# Altium project SpinASM.PrjPCB
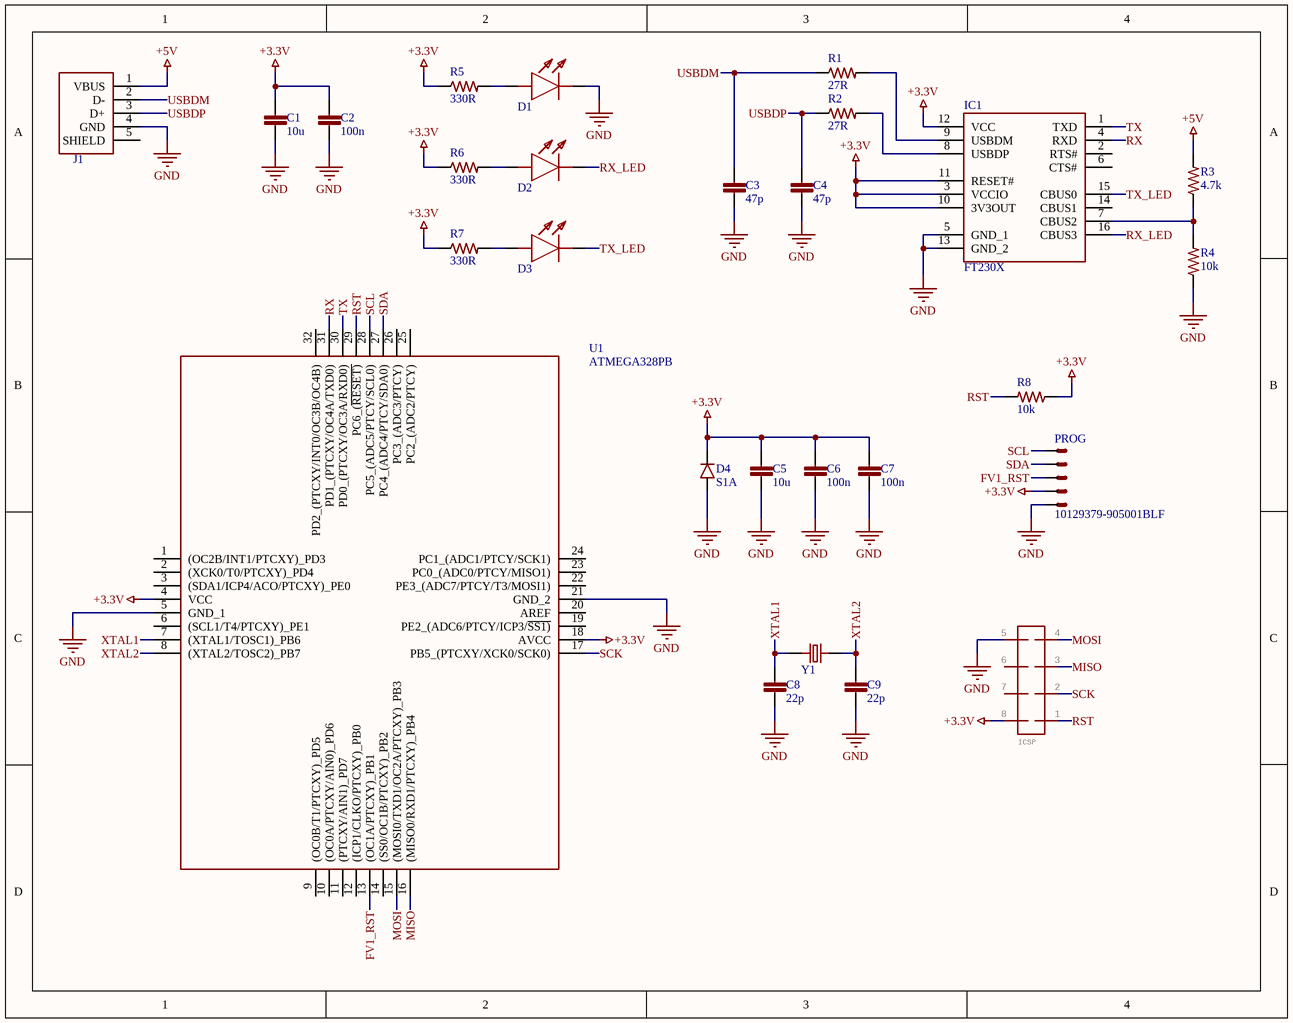
[diagram p0: SpinASM.SchDoc]
1 sheet, 27 parts. Net scope: global (net labels, ports and power ports of the same name join across sheets).
Board files: Panel.PcbDoc, SpinASM.PcbDoc

## Sheet SpinASM.SchDoc
size A

### Parts
C1  10u  [CHIP_1206]
C2  100n  [CHIP_0603]
C3  47p  [CHIP_0603]
C4  47p  [CHIP_0603]
C5  10u  [CHIP_1206]
C6  100n  [CHIP_0603]
C7  100n  [CHIP_0603]
C8  22p  [CHIP_0603]
C9  22p  [CHIP_0603]
D1  GREEN  [LED_0603]  (value not drawn)
D2  RED  [LED_0603]  (value not drawn)
D3  RED  [LED_0603]  (value not drawn)
D4  S1A  [DO214]
IC1  FT230X  [TSSOP-16]
ICSP  J_SOICBITE  [SOICBITE]  (value not drawn)
J1  USB_MALE  [USB_MALE]  (value not drawn)
PROG  10129379-905001BLF  [HEADER_5PINS_MALE_90]
R1  27R  [CHIP_R_0603]
R2  27R  [CHIP_R_0603]
R3  4.7k  [CHIP_R_0603]
R4  10k  [CHIP_R_0603]
R5  330R  [CHIP_R_0603]
R6  330R  [CHIP_R_0603]
R7  330R  [CHIP_R_0603]
R8  10k  [CHIP_R_0603]
U1  ATMEGA328PB  [TQFP32]
Y1  ABM10  [ABM10-167]  (value not drawn)

### Nets
+3.3V: C1.2 C2.1 C5.2 C6.1 C7.1 D4.1 IC1.3(VCCIO) IC1.10(3V3OUT) IC1.11(RESET#) IC1.12(VCC) ICSP.8(P$8) PROG.2(S) R5.1 R6.1 R7.1 R8.1 U1.4(VCC) U1.18(AVCC)
+5V: J1.1(VBUS) R3.2
GND: C1.1 C2.2 C3.2 C4.2 C5.1 C6.2 C7.2 C8.2 C9.2 D1.1(K) D4.2 IC1.5(GND_1) IC1.13(GND_2) ICSP.5(P$5) J1.4(GND) PROG.1(S) R4.1 U1.5(GND_1) U1.21(GND_2)
FV1_RST: PROG.3(S) U1.13((OC1A/PTCXY)_PB1)
MISO: ICSP.3(P$3) U1.16((MISO0/RXD1/PTCXY)_PB4)
MOSI: ICSP.4(P$4) U1.15((MOSI0/TXD1/OC2A/PTCXY)_PB3)
RST: ICSP.1(P$1) R8.2 U1.29(PC6_(~{RESET)})
RX: IC1.4(RXD) U1.31(PD1_(PTCXY/OC4A/TXD0))
RX_LED: D2.1(K) IC1.16(CBUS3)
SCK: ICSP.2(P$2) U1.17(PB5_(PTCXY/XCK0/SCK0))
SCL: PROG.5(S) U1.28(PC5_(ADC5/PTCY/SCL0))
SDA: PROG.4(S) U1.27(PC4_(ADC4/PTCY/SDA0))
TX: IC1.1(TXD) U1.30(PD0_(PTCXY/OC3A/RXD0))
TX_LED: D3.1(K) IC1.15(CBUS0)
USBDM: C3.1 J1.2(D-) R1.1
USBDP: C4.1 J1.3(D+) R2.1
XTAL1: C8.1 U1.7((XTAL1/TOSC1)_PB6) Y1.1
XTAL2: C9.1 U1.8((XTAL2/TOSC2)_PB7) Y1.2
NetD1_2: D1.2(A) R5.2
NetD2_2: D2.2(A) R6.2
NetD3_2: D3.2(A) R7.2
NetIC1_7: IC1.7(CBUS2) R3.1 R4.2
NetIC1_8: IC1.8(USBDP) R2.2
NetIC1_9: IC1.9(USBDM) R1.2

Not connected (* = marked no-connect by the designer): IC1 2(RTS#) 6(CTS#) 14(CBUS1); ICSP 6(P$6) 7(P$7); J1 5(SHIELD); U1 1((OC2B/INT1/PTCXY)_PD3) 2((XCK0/T0/PTCXY)_PD4) 3((SDA1/ICP4/ACO/PTCXY)_PE0) 6((SCL1/T4/PTCXY)_PE1) 9((OC0B/T1/PTCXY)_PD5) 10((OC0A/PTCXY/AIN0)_PD6) 11((PTCXY/AIN1)_PD7) 12((ICP1/CLKO/PTCXY)_PB0) 14((SS0/OC1B/PTCXY)_PB2) 19(PE2_(ADC6/PTCY/ICP3/~{SS1)}) 20(AREF) 22(PE3_(ADC7/PTCY/T3/MOSI1)) 23(PC0_(ADC0/PTCY/MISO1)) 24(PC1_(ADC1/PTCY/SCK1)) 25(PC2_(ADC2/PTCY)) 26(PC3_(ADC3/PTCY)) 32(PD2_(PTCXY/INT0/OC3B/OC4B))

### Library data of the parts
C1 C5 = TMK316B7106KL-TD: CAP CER 10uF 25V X7R 1206; Manufacturer: Taiyo Yuden; Tolerance: 10%; Supplier 1: Farnell; Supplier Part Number 1: 2113073; Manufacturer Part Number: TMK316B7106KL-TD; RoHS: Yes; Category: Ceramic Capacitors; Stock: 588931; Mount: Surface Mount; Case/Package: 1206; Number of Pins: 2; Case Code (Imperial): 1206; Case Code (Metric): 3216; Weight: 0.000571oz; Min Operating Temperature: -55°C; Max Operating Temperature: 125°C; Capacitance: 10uF; Voltage Rating: 25V; Packaging: Tape and Reel; Dielectric: X7R; Voltage Rating (DC): 25V; Package Quantity: 1; Termination: SMD/SMT; Resistor Type: Ceramic; Length: 0.126inch; Width: 1.6mm; Height: 1.6mm; Thickness: 0.071inch; REACH SVHC: Unknown; ComponentLink1URL: https://datasheet.ciiva.com/15922/582tmk316ab7106kl-t-15922403.pdf?src-supplier=Onlinecomponents.com; ComponentLink1Description: https://datasheet.ciiva.com/15922/582tmk316ab7106kl-t-15922403.pdf?src-supplier=Onlinecomponents.com; ComponentLink2URL: https://datasheet.ciiva.com/7975/1784422-7975593.pdf?src-supplier=Element14; ComponentLink2Description: https://datasheet.ciiva.com/7975/1784422-7975593.pdf?src-supplier=Element14; ComponentLink3URL: https://datasheet.ciiva.com/30123/25tmk316ab7106kl-t-30123726.pdf?src-supplier=Onlinecomponents.com; ComponentLink3Description: https://datasheet.ciiva.com/30123/25tmk316ab7106kl-t-30123726.pdf?src-supplier=Onlinecomponents.com; ComponentLink4URL: https://datasheet.ciiva.com/7975/mlcc-all-e-7975834.pdf?src-supplier=Element14; ComponentLink4Description: https://datasheet.ciiva.com/7975/mlcc-all-e-7975834.pdf?src-supplier=Element14; ComponentLink5URL: https://datasheet.ciiva.com/139/mlcc-all-e-139531.pdf?src-supplier=Digi-Key; ComponentLink5Description: https://datasheet.ciiva.com/139/mlcc-all-e-139531.pdf?src-supplier=Digi-Key; ComponentLink6URL: https://datasheet.ciiva.com/22748/1481447-22748971.pdf?src-supplier=Element14; ComponentLink6Description: https://datasheet.ciiva.com/22748/1481447-22748971.pdf?src-supplier=Element14; ComponentLink7URL: https://datasheet.ciiva.com/139/mlcc-all-e-139532.pdf?src-supplier=Digi-Key; ComponentLink7Description: https://datasheet.ciiva.com/139/mlcc-all-e-139532.pdf?src-supplier=Digi-Key; ComponentLink8URL: https://datasheet.ciiva.com/139/mlcc-all-e-139533.pdf?src-supplier=Digi-Key; ComponentLink8Description: https://datasheet.ciiva.com/139/mlcc-all-e-139533.pdf?src-supplier=Digi-Key; Price: 0.149
C2 C6 C7 = MC0603B104K500CT: CAP CER 100NF 50V X7R 0603; Manufacturer: Multicomp; Tolerance: 10%; Supplier 1: Farnell; Supplier Part Number 1: 1759122; Manufacturer Part Number: MC0603B104K500CT; Stock 1: 1057763; RoHS: Yes; Case/Package: 0603; Number of Pins: 2; Case Code (Metric): 1608; Case Code (Imperial): 0603; Min Operating Temperature: -55°C; Max Operating Temperature: 125°C; Packaging: Cut Tape; Voltage Rating: 50V; Capacitance: 100nF; Dielectric: X7R; Voltage Rating (DC): 50V; REACH SVHC: Unknown; ComponentLink1URL: https://datasheet.ciiva.com/22686/1901289-22686278.pdf?src-supplier=Element14; ComponentLink1Description: https://datasheet.ciiva.com/22686/1901289-22686278.pdf?src-supplier=Element14; ComponentLink2URL: https://datasheet.ciiva.com/22686/1901289-22686279.pdf?src-supplier=Element14; ComponentLink2Description: https://datasheet.ciiva.com/22686/1901289-22686279.pdf?src-supplier=Element14; ComponentLink3URL: https://datasheet.ciiva.com/22648/1901289-22648411.pdf?src-supplier=Element14; ComponentLink3Description: https://datasheet.ciiva.com/22648/1901289-22648411.pdf?src-supplier=Element14; Price: 0.0458
C3 C4 = MC0603N470J500CT: CAP CER 47PF 50V C0G/NP0 0603; Manufacturer: Multicomp; Tolerance: 5%; Dielectric: C0G; Temperature Coefficient: 30ppm/°C; Supplier 1: Farnell; Supplier Part Number 1: 1759062; Manufacturer Part Number: MC0603N470J500CT; Stock: 148629; Pricing: 10=0.0246, 100=0.0199, 500=0.0123, 1000=0.0097, 2000=0.0089 (EUR); RoHS: Yes; Case/Package: 0603; Number of Pins: 2; Case Code (Metric): 1608; Case Code (Imperial): 0603; Min Operating Temperature: -55°C; Max Operating Temperature: 125°C; Packaging: Tape and Reel; Voltage Rating: 50V; Capacitance: 47pF; Voltage Rating (DC): 50V; Width: 0.8mm; REACH SVHC: Unknown; ComponentLink1URL: https://datasheet.ciiva.com/22648/1901289-22648503.pdf?src-supplier=Element14; ComponentLink1Description: https://datasheet.ciiva.com/22648/1901289-22648503.pdf?src-supplier=Element14; ComponentLink2URL: https://datasheet.ciiva.com/22682/1901289-22682812.pdf?src-supplier=Element14; ComponentLink2Description: https://datasheet.ciiva.com/22682/1901289-22682812.pdf?src-supplier=Element14; ComponentLink3URL: https://datasheet.ciiva.com/22682/1901289-22682813.pdf?src-supplier=Element14; ComponentLink3Description: https://datasheet.ciiva.com/22682/1901289-22682813.pdf?src-supplier=Element14; Price: 0.02
C8 C9 = MC0603N220J500CT: CAP CER 22PF 50V C0G/NP0 0603; Manufacturer: Multicomp; Temperature Coefficient: 30ppm/°C; Dielectric: C0G; Tolerance: 5%; Supplier 1: Farnell; Supplier Part Number 1: 1759057; Manufacturer Part Number: MC0603N220J500CT; RoHS: Yes; Category: Ceramic Capacitors; Stock: 53792; Case/Package: 0603; Number of Pins: 2; Case Code (Imperial): 0603; Case Code (Metric): 1608; Min Operating Temperature: -55°C; Max Operating Temperature: 125°C; Voltage Rating (DC): 50V; Capacitance: 22pF; Voltage Rating: 50V; Packaging: Cut Tape; Width: 0.8mm; REACH SVHC: Unknown; ComponentLink1URL: https://datasheet.ciiva.com/22648/1901289-22648486.pdf?src-supplier=Element14; ComponentLink1Description: https://datasheet.ciiva.com/22648/1901289-22648486.pdf?src-supplier=Element14; Price: 0.024
D1 = APT1608SGC: LED GREEN CLEAR CHIP SMD; Manufacturer: Kingbright; Forward Voltage: 2.2V; Viewing Angle: 120°; Forward Current: 20mA; Luminous Intensity: 15mcd; Lens Style: Clear,Flat; Dominant Wavelength: 568nm; Number of LEDs: 1; Supplier 1: Mouser; Supplier Part Number 1: 604-APT1608SGC; Manufacturer Part Number: APT1608SGC; RoHS: Yes; Category: LEDs; Stock: 233491; Pricing: 1=0.17000, 10=0.10700, 100=0.05600, 1000=0.05100, 2000=0.04400, 10000=0.03700 (USD); Mount: Surface Mount; Case/Package: 0603; Number of Pins: 2; Color: Green; Case Code (Metric): 1608; Case Code (Imperial): 0603; Lens Color: Clear; Min Operating Temperature: -40°C; Max Operating Temperature: 85°C; Package Quantity: 2000; Illumination Color: Green; Packaging: Tape and Reel; Test Current: 20mA; Wavelength: 568nm; Length: 1.6mm; Height: 0.75mm; Width: 0.8mm; Lead Free: Lead Free; ComponentLink1URL: https://datasheet.ciiva.com/2113/apt1608sgc-2113808.pdf?src-supplier=Digi-Key; ComponentLink1Description: https://datasheet.ciiva.com/2113/apt1608sgc-2113808.pdf?src-supplier=Digi-Key; ComponentLink2URL: https://datasheet.ciiva.com/12400/apt1608sgc-32861-12400932.pdf?src-supplier=Mouser; ComponentLink2Description: https://datasheet.ciiva.com/12400/apt1608sgc-32861-12400932.pdf?src-supplier=Mouser; ComponentLink3URL: https://datasheet.ciiva.com/14603/70062839-14603927.pdf?src-supplier=Allied+Electronics; ComponentLink3Description: https://datasheet.ciiva.com/14603/70062839-14603927.pdf?src-supplier=Allied+Electronics; Price: 0.047
D2 D3 = APT1608EC: LED RED CLEAR CHIP SMD; Manufacturer: Kingbright; Forward Current: 20mA; Forward Voltage: 2V; Luminous Intensity: 12mcd; Viewing Angle: 120°; Lens Style: Clear,Flat; Dominant Wavelength: 625nm; Number of LEDs: 1; Supplier 1: Mouser; Supplier Part Number 1: 604-APT1608EC; Manufacturer Part Number: APT1608EC; RoHS: Yes; Category: LEDs; Stock: 24294; Pricing: 1=0.16000, 10=0.11500, 100=0.06200, 1000=0.04300, 2000=0.03600, 10000=0.03600 (USD); Mount: Surface Mount; Case/Package: 0603; Number of Pins: 2; Color: Red; Case Code (Metric): 1608; Case Code (Imperial): 0603; Lens Color: Clear; Min Operating Temperature: -40°C; Max Operating Temperature: 85°C; Illumination Color: Red; Packaging: Tape and Reel; Package Quantity: 2000; Test Current: 20mA; Wavelength: 625nm; Length: 1.6mm; Height: 0.75mm; Width: 0.8mm; Lead Free: Lead Free; ComponentLink1URL: https://datasheet.ciiva.com/2113/apt1608ec-2113818.pdf?src-supplier=Digi-Key; ComponentLink1Description: https://datasheet.ciiva.com/2113/apt1608ec-2113818.pdf?src-supplier=Digi-Key; ComponentLink2URL: https://datasheet.ciiva.com/12400/apt1608ec-34957-12400703.pdf?src-supplier=Mouser; ComponentLink2Description: https://datasheet.ciiva.com/12400/apt1608ec-34957-12400703.pdf?src-supplier=Mouser; ComponentLink3URL: https://datasheet.ciiva.com/2113/apt1608ec-2113819.pdf?src-supplier=Digi-Key; ComponentLink3Description: https://datasheet.ciiva.com/2113/apt1608ec-2113819.pdf?src-supplier=Digi-Key; ComponentLink4URL: https://datasheet.ciiva.com/2113/apt1608ec-2113820.pdf?src-supplier=Digi-Key; ComponentLink4Description: https://datasheet.ciiva.com/2113/apt1608ec-2113820.pdf?src-supplier=Digi-Key; ComponentLink5URL: https://datasheet.ciiva.com/14604/70062836-14604396.pdf?src-supplier=Allied+Electronics; ComponentLink5Description: https://datasheet.ciiva.com/14604/70062836-14604396.pdf?src-supplier=Allied+Electronics; ComponentLink6URL: https://datasheet.ciiva.com/16412/apt1608ec-16412172.pdf?src-supplier=Future+Electronics; ComponentLink6Description: https://datasheet.ciiva.com/16412/apt1608ec-16412172.pdf?src-supplier=Future+Electronics; Price: 0.053
D4 = S1A: DIODE GEN PURP 50V 1A SMA; Manufacturer: ON Semiconductor / Fairchild; Peak Reverse Current: 1uA; Max Surge Current: 40A; Forward Voltage: 1.1V; Peak Non-Repetitive Surge Current: 30A; Element Configuration: Single; Capacitance: 12pF; Recovery Time: 1800ns; Reverse Recovery Time: 1.8us; Polarity: Standard; Power Dissipation: 1.4W; Supplier 1: Farnell; Supplier Part Number 1: 9843868; Manufacturer Part Number: S1A; Stock: 34555; Pricing: 5=0.184, 25=0.179, 100=0.0727, 250=0.0669, 500=0.0667, 1000=0.0364, 5000=0.0293 (EUR); RoHS: Yes; Mount: Surface Mount; Case/Package: SMA; Number of Pins: 2; Weight: 0.106g; Contact Plating: Tin; Min Operating Temperature: -55°C; Max Operating Temperature: 150°C; Packaging: Tape and Reel; Package Quantity: 1; Voltage Rating (DC): 50V; Current Rating: 1A; Output Current: 1A; Forward Current: 1A; Max Repetitive Reverse Voltage (Vrrm): 50V; Average Rectified Current: 1A; Max Forward Surge Current (Ifsm): 30A; Max Reverse Voltage (DC): 50V; Reverse Voltage: 50V; Width: 5.28mm; Radiation Hardening: No; REACH SVHC: No SVHC; Lead Free: Lead Free; ComponentLink1URL: https://datasheet.ciiva.com/910/s1a-910480.pdf?src-supplier=Avnet; ComponentLink1Description: https://datasheet.ciiva.com/910/s1a-910480.pdf?src-supplier=Avnet; ComponentLink2URL: https://datasheet.ciiva.com/23683/1730038-23683616.pdf?src-supplier=Newark; ComponentLink2Description: https://datasheet.ciiva.com/23683/1730038-23683616.pdf?src-supplier=Newark; ComponentLink3URL: https://datasheet.ciiva.com/4452/s1a-191336-4452662.pdf?src-supplier=Mouser; ComponentLink3Description: https://datasheet.ciiva.com/4452/s1a-191336-4452662.pdf?src-supplier=Mouser; ComponentLink4URL: https://datasheet.ciiva.com/25624/0900766b80f9b629-25624903.pdf?src-supplier=RSComponents; ComponentLink4Description: https://datasheet.ciiva.com/25624/0900766b80f9b629-25624903.pdf?src-supplier=RSComponents; ComponentLink5URL: https://datasheet.ciiva.com/916/s1a-916898.pdf?src-supplier=Digi-Key; ComponentLink5Description: https://datasheet.ciiva.com/916/s1a-916898.pdf?src-supplier=Digi-Key; ComponentLink6URL: https://datasheet.ciiva.com/916/s1a-916899.pdf?src-supplier=Digi-Key; ComponentLink6Description: https://datasheet.ciiva.com/916/s1a-916899.pdf?src-supplier=Digi-Key; ComponentLink7URL: https://datasheet.ciiva.com/916/s1a-916900.pdf?src-supplier=Digi-Key; ComponentLink7Description: https://datasheet.ciiva.com/916/s1a-916900.pdf?src-supplier=Digi-Key; ComponentLink8URL: https://datasheet.ciiva.com/16800/s1a-16800103.pdf?src-supplier=Future+Electronics; ComponentLink8Description: https://datasheet.ciiva.com/16800/s1a-16800103.pdf?src-supplier=Future+Electronics; ComponentLink9URL: https://datasheet.ciiva.com/28469/1766308-28469031.pdf?src-supplier=Element14; ComponentLink9Description: https://datasheet.ciiva.com/28469/1766308-28469031.pdf?src-supplier=Element14; ComponentLink10URL: https://datasheet.ciiva.com/26231/s1k-26231832.pdf?src-supplier=Avnet+Europe; ComponentLink10Description: https://datasheet.ciiva.com/26231/s1k-26231832.pdf?src-supplier=Avnet+Europe; ComponentLink11URL: https://datasheet.ciiva.com/16474/s1k-16474283.pdf?src-supplier=Avnet+Asia; ComponentLink11Description: https://datasheet.ciiva.com/16474/s1k-16474283.pdf?src-supplier=Avnet+Asia; Price: 0.072
IC1 = FT230XS-R: USB-to-UART 1-CH 512byte FIFO 5V 16-Pin SSOP T/R; Manufacturer: FTDI; Data Rate: 12Mbps; Number of Channels: 1; Max Supply Voltage: 5.5V; Min Supply Voltage: 2.97V; Interface: UART,USB; Operating Supply Current: 8mA; Supplier 1: Farnell; Supplier Part Number 1: 2081321; Manufacturer Part Number: FT230XS-R; RoHS: Yes; Category: Interface ICs; Stock 1: 45264; Mount: Surface Mount; Case/Package: SSOP; Number of Pins: 16; Weight: 0.004586oz; Min Operating Temperature: -40°C; Max Operating Temperature: 85°C; Packaging: Tape and Reel; Package Quantity: 3000; Operating Supply Voltage: 5V; Length: 5mm; Height: 0.059inch; Width: 0.157inch; ComponentLink1URL: https://datasheet.ciiva.com/1787/ds-ft230x-1787315.pdf?src-supplier=Digi-Key; ComponentLink1Description: https://datasheet.ciiva.com/1787/ds-ft230x-1787315.pdf?src-supplier=Digi-Key; ComponentLink2URL: https://datasheet.ciiva.com/4787/ds-ft230x-5395-4787571.pdf?src-supplier=Mouser; ComponentLink2Description: https://datasheet.ciiva.com/4787/ds-ft230x-5395-4787571.pdf?src-supplier=Mouser; ComponentLink3URL: https://datasheet.ciiva.com/30478/0900766b811020cb-30478167.pdf?src-supplier=RSComponents; ComponentLink3Description: https://datasheet.ciiva.com/30478/0900766b811020cb-30478167.pdf?src-supplier=RSComponents; ComponentLink4URL: https://datasheet.ciiva.com/1787/ft-x-series-1787316.pdf?src-supplier=Digi-Key; ComponentLink4Description: https://datasheet.ciiva.com/1787/ft-x-series-1787316.pdf?src-supplier=Digi-Key; ComponentLink5URL: https://datasheet.ciiva.com/1787/ft-x-series-1787317.pdf?src-supplier=Digi-Key; ComponentLink5Description: https://datasheet.ciiva.com/1787/ft-x-series-1787317.pdf?src-supplier=Digi-Key; Price: 1.73
ICSP = J_SOICBITE: GateName_1: G$1; SymbolName_1: SOICBITE; LibraryName: SOICbite_Eagle; DeviceSetName: SOICBITE; Package: SOICBITE
J1 = KUSBX-SMT2AP5S-W: Conn USB Type A PL 4 POS 2mm Solder ST SMD 4 Terminal 1 Port; Manufacturer: Kycon; Number of Ports: 1; Number of Contacts: 4; Connector Type: USB,Plug; Insulation Resistance: 1GR; Gender: Male; Current Rating: 1A; Supplier 1: Mouser; Manufacturer Part Number: KUSBX-SMT2AP5S-W; RoHS: Yes; Category: USB Connectors; Mount: Surface Mount; Housing Material: Thermoplastic; Contact Plating: Gold; Contact Material: Bronze; Color: Black; Termination: SMD/SMT; Orientation: Straight; Packaging: Tray; Pitch: 2mm; Radiation Hardening: No; ComponentLink1URL: https://datasheet.ciiva.com/12494/kusbx-371999-12494840.pdf?src-supplier=Mouser; ComponentLink1Description: https://datasheet.ciiva.com/12494/kusbx-371999-12494840.pdf?src-supplier=Mouser; Price: 0.735; Stock 1: 8377; Package Quantity: 100; Number of Positions: 4; Flammability Rating: UL94 V-0
PROG = 10129379-905001BLF: Conn Unshrouded Header HDR 5 POS 2.54mm Solder RA Thru-Hole Poly Bag; Manufacturer: ICC; Supplier 1: Mouser; Supplier Part Number 1: 649-1012937990501BLF; Manufacturer Part Number: 10129379-905001BLF; Stock: 5866; Pricing: 1=0.26000, 10=0.18200, 100=0.15000, 1000=0.12500, 2500=0.11200, 10000=0.09600, 25000=0.09500, 50000=0.09300, 100000=0.08900 (USD); ComponentLink1URL: http://datasheet.octopart.com/10129379-905001BLF-Amphenol-ICC-datasheet-100454231.pdf?src-supplier=Newark; ComponentLink1Description: http://datasheet.octopart.com/10129379-905001BLF-Amphenol-ICC-datasheet-100454231.pdf?src-supplier=Newark; ComponentLink2URL: http://datasheet.octopart.com/10129379-905001BLF-ICC-datasheet-100454231.pdf?src-supplier=Newark; ComponentLink2Description: http://datasheet.octopart.com/10129379-905001BLF-ICC-datasheet-100454231.pdf?src-supplier=Newark; Price: 0.154
R1 R2 = CRCW060327R0FKEA: RES SMD 27 OHM 1% 1/10W 0603; Manufacturer: Vishay; Power Rating: 100mW; Temperature Coefficient: 100ppm/°C; Voltage Rating: 75V; Supplier 1: Farnell; Supplier Part Number 1: 2141211; Manufacturer Part Number: CRCW060327R0FKEA; RoHS: Yes; Category: Chip SMD Resistors; Stock 1: 1183; Mount: Surface Mount; Case/Package: 0603; Number of Pins: 2; Weight: 7.1E-05oz; Contact Plating: Tin; Case Code (Imperial): 0603; Case Code (Metric): 1608; Min Operating Temperature: -55°C; Max Operating Temperature: 155°C; Resistance: 27R; Tolerance: 1%; Composition: Thick Film; Packaging: Tape and Reel; Termination: SMD/SMT; Package Quantity: 5000; Military Standard: Not; Voltage Rating (DC): 75V; Length: 1.55mm; Height: 0.45mm; Width: 0.85mm; Depth: 0.85mm; Radiation Hardening: No; REACH SVHC: Unknown; Lead Free: Lead Free; ComponentLink1URL: https://datasheet.ciiva.com/11809/0900766b80d98afc-11809194.pdf?src-supplier=RSComponents; ComponentLink1Description: https://datasheet.ciiva.com/11809/0900766b80d98afc-11809194.pdf?src-supplier=RSComponents; ComponentLink2URL: https://datasheet.ciiva.com/5541/dcrcwe3-109170-5541782.pdf?src-supplier=Mouser; ComponentLink2Description: https://datasheet.ciiva.com/5541/dcrcwe3-109170-5541782.pdf?src-supplier=Mouser; ComponentLink3URL: https://datasheet.ciiva.com/7792/125364-7792167.pdf?src-supplier=Element14; ComponentLink3Description: https://datasheet.ciiva.com/7792/125364-7792167.pdf?src-supplier=Element14; ComponentLink4URL: https://datasheet.ciiva.com/22704/1697337-22704440.pdf?src-supplier=Element14; ComponentLink4Description: https://datasheet.ciiva.com/22704/1697337-22704440.pdf?src-supplier=Element14; ComponentLink5URL: https://datasheet.ciiva.com/7672/1697337-7672889.pdf?src-supplier=Element14; ComponentLink5Description: https://datasheet.ciiva.com/7672/1697337-7672889.pdf?src-supplier=Element14; ComponentLink6URL: https://datasheet.ciiva.com/7672/1697337-7672890.pdf?src-supplier=Element14; ComponentLink6Description: https://datasheet.ciiva.com/7672/1697337-7672890.pdf?src-supplier=Element14; ComponentLink7URL: https://datasheet.ciiva.com/16882/dcrcwe3-16882811.pdf?src-supplier=Avnet+Europe; ComponentLink7Description: https://datasheet.ciiva.com/16882/dcrcwe3-16882811.pdf?src-supplier=Avnet+Europe; ComponentLink8URL: https://datasheet.ciiva.com/22870/70201119-22870860.pdf?src-supplier=Allied+Electronics; ComponentLink8Description: https://datasheet.ciiva.com/22870/70201119-22870860.pdf?src-supplier=Allied+Electronics; ComponentLink9URL: https://datasheet.ciiva.com/16498/dcrcwe3-16498302.pdf?src-supplier=Future+Electronics; ComponentLink9Description: https://datasheet.ciiva.com/16498/dcrcwe3-16498302.pdf?src-supplier=Future+Electronics; ComponentLink10URL: https://datasheet.ciiva.com/16780/70201119-16780479.pdf?src-supplier=Allied+Electronics; ComponentLink10Description: https://datasheet.ciiva.com/16780/70201119-16780479.pdf?src-supplier=Allied+Electronics; Price: 0.0165
R3 = CRCW06034K70FKEA: RES SMD 4.7K OHM 1% 1/10W 0603; Manufacturer: Vishay; Resistance: 4.7kR; Temperature Coefficient: 100ppm/°C; Power Rating: 100mW; Voltage Rating: 75V; Supplier 1: Farnell; Supplier Part Number 1: 1469807; Manufacturer Part Number: CRCW06034K70FKEA; Stock: 238464; Pricing: 10=0.0169, 100=0.013, 500=0.0113, 1000=0.0074 (EUR); RoHS: Yes; Mount: Surface Mount; Case/Package: 0603; Weight: 7.1E-05oz; Contact Plating: Tin; Case Code (Imperial): 0603; Case Code (Metric): 1608; Min Operating Temperature: -55°C; Max Operating Temperature: 155°C; Tolerance: 1%; Composition: Thick Film; Termination: SMD/SMT; Packaging: Tape and Reel; Package Quantity: 5000; Military Standard: Not; Voltage Rating (DC): 75V; Length: 1.55mm; Height: 0.45mm; Width: 0.85mm; Depth: 0.85mm; Lead Free: Lead Free; REACH SVHC: Unknown; ComponentLink1URL: https://datasheet.ciiva.com/11809/0900766b80d98afc-11809859.pdf?src-supplier=RSComponents; ComponentLink1Description: https://datasheet.ciiva.com/11809/0900766b80d98afc-11809859.pdf?src-supplier=RSComponents; ComponentLink2URL: https://datasheet.ciiva.com/8079/1697337-8079646.pdf?src-supplier=Element14; ComponentLink2Description: https://datasheet.ciiva.com/8079/1697337-8079646.pdf?src-supplier=Element14; ComponentLink3URL: https://datasheet.ciiva.com/15159/getdatasheetpartid-33073-15159382.pdf?src-supplier=Verical; ComponentLink3Description: https://datasheet.ciiva.com/15159/getdatasheetpartid-33073-15159382.pdf?src-supplier=Verical; ComponentLink4URL: https://datasheet.ciiva.com/16199/dcrcwe3-16199366.pdf?src-supplier=Future+Electronics; ComponentLink4Description: https://datasheet.ciiva.com/16199/dcrcwe3-16199366.pdf?src-supplier=Future+Electronics; ComponentLink5URL: https://datasheet.ciiva.com/16764/70201119-16764918.pdf?src-supplier=Allied+Electronics; ComponentLink5Description: https://datasheet.ciiva.com/16764/70201119-16764918.pdf?src-supplier=Allied+Electronics; ComponentLink6URL: https://datasheet.ciiva.com/16520/dcrcwe3-16520616.pdf?src-supplier=Avnet+Asia; ComponentLink6Description: https://datasheet.ciiva.com/16520/dcrcwe3-16520616.pdf?src-supplier=Avnet+Asia; ComponentLink7URL: https://datasheet.ciiva.com/16724/70201119-16724106.pdf?src-supplier=Allied+Electronics; ComponentLink7Description: https://datasheet.ciiva.com/16724/70201119-16724106.pdf?src-supplier=Allied+Electronics; ComponentLink8URL: https://datasheet.ciiva.com/26314/fld-crcw-e3-data-en-26314735.pdf?src-supplier=Distrelec; ComponentLink8Description: https://datasheet.ciiva.com/26314/fld-crcw-e3-data-en-26314735.pdf?src-supplier=Distrelec; Price: 0.0131
R4 R8 = CRCW060310K0FKEA: RES SMD 10K OHM 1% 1/10W 0603; Manufacturer: Vishay; Resistance: 10kR; Temperature Coefficient: 100ppm/°C; Power Rating: 100mW; Voltage Rating: 75V; Supplier 1: Farnell; Supplier Part Number 1: 1469748; Manufacturer Part Number: CRCW060310K0FKEA; Stock: 1391124; Pricing: 10=0.0169, 100=0.013, 500=0.0113, 1000=0.008 (EUR); RoHS: Yes; Case/Package: 0603; Number of Pins: 2; Weight: 7.1E-05oz; Contact Plating: Tin; Case Code (Metric): 1608; Case Code (Imperial): 0603; Min Operating Temperature: -55°C; Max Operating Temperature: 155°C; Tolerance: 1%; Composition: Thick Film; Packaging: Tape and Reel; Package Quantity: 10; Number of Terminations: 2; Military Standard: Not; Termination: SMD/SMT; Max Power Dissipation: 100mW; Voltage Rating (DC): 75V; Features: Automotive AEC-Q200; Length: 1.55mm; Height: 0.45mm; Width: 0.033inch; Depth: 0.85mm; Radiation Hardening: No; Lead Free: Lead Free; REACH SVHC: Unknown; ComponentLink1URL: https://datasheet.ciiva.com/11809/0900766b80d98afc-11809037.pdf?src-supplier=RSComponents; ComponentLink1Description: https://datasheet.ciiva.com/11809/0900766b80d98afc-11809037.pdf?src-supplier=RSComponents; ComponentLink2URL: https://datasheet.ciiva.com/16886/dcrcw-16886037.pdf?src-supplier=Avnet+Europe; ComponentLink2Description: https://datasheet.ciiva.com/16886/dcrcw-16886037.pdf?src-supplier=Avnet+Europe; ComponentLink3URL: https://datasheet.ciiva.com/26821/getdatasheetpartid-86831-26821109.pdf?src-supplier=Verical; ComponentLink3Description: https://datasheet.ciiva.com/26821/getdatasheetpartid-86831-26821109.pdf?src-supplier=Verical; ComponentLink4URL: https://datasheet.ciiva.com/16754/70201119-16754710.pdf?src-supplier=Allied+Electronics; ComponentLink4Description: https://datasheet.ciiva.com/16754/70201119-16754710.pdf?src-supplier=Allied+Electronics; ComponentLink5URL: https://datasheet.ciiva.com/16719/70201119-16719704.pdf?src-supplier=Allied+Electronics; ComponentLink5Description: https://datasheet.ciiva.com/16719/70201119-16719704.pdf?src-supplier=Allied+Electronics; ComponentLink6URL: https://datasheet.ciiva.com/2465/dcrcwe3-2465513.pdf?src-supplier=Digi-Key; ComponentLink6Description: https://datasheet.ciiva.com/2465/dcrcwe3-2465513.pdf?src-supplier=Digi-Key; ComponentLink7URL: https://datasheet.ciiva.com/5543/dcrcwe3-109170-5543001.pdf?src-supplier=Mouser; ComponentLink7Description: https://datasheet.ciiva.com/5543/dcrcwe3-109170-5543001.pdf?src-supplier=Mouser; ComponentLink8URL: https://datasheet.ciiva.com/2465/dcrcwe3-2465514.pdf?src-supplier=Digi-Key; ComponentLink8Description: https://datasheet.ciiva.com/2465/dcrcwe3-2465514.pdf?src-supplier=Digi-Key; ComponentLink9URL: https://datasheet.ciiva.com/46385/1697337-46385498.pdf?src-supplier=Element14; ComponentLink9Description: https://datasheet.ciiva.com/46385/1697337-46385498.pdf?src-supplier=Element14; ComponentLink10URL: https://datasheet.ciiva.com/2465/dcrcwe3-2465515.pdf?src-supplier=Digi-Key; ComponentLink10Description: https://datasheet.ciiva.com/2465/dcrcwe3-2465515.pdf?src-supplier=Digi-Key; ComponentLink11URL: https://datasheet.ciiva.com/3256/dcrcwe3-3256939.pdf?src-supplier=Avnet; ComponentLink11Description: https://datasheet.ciiva.com/3256/dcrcwe3-3256939.pdf?src-supplier=Avnet; ComponentLink12URL: https://datasheet.ciiva.com/3256/dcrcwe3-3256940.pdf?src-supplier=Avnet; ComponentLink12Description: https://datasheet.ciiva.com/3256/dcrcwe3-3256940.pdf?src-supplier=Avnet; ComponentLink13URL: https://datasheet.ciiva.com/16209/dcrcwe3-16209164.pdf?src-supplier=Future+Electronics; ComponentLink13Description: https://datasheet.ciiva.com/16209/dcrcwe3-16209164.pdf?src-supplier=Future+Electronics; ComponentLink14URL: https://datasheet.ciiva.com/26314/fld-crcw-e3-data-en-26314749.pdf?src-supplier=Distrelec; ComponentLink14Description: https://datasheet.ciiva.com/26314/fld-crcw-e3-data-en-26314749.pdf?src-supplier=Distrelec; Price: 0.0131
R5-R7 = CRCW0603330RFKEA: RES SMD 330R OHM 1% 1/10W 0603; Manufacturer: Vishay; Temperature Coefficient: 100ppm/°C; Power Rating: 100mW; Voltage Rating: 75V; Supplier 1: Farnell; Supplier Part Number 1: 1469803; Manufacturer Part Number: CRCW0603330RFKEA; RoHS: Yes; Category: Chip SMD Resistors; Stock: 92220; Pricing: 10=0.04600, 100=0.01830, 500=0.01570, 1000=0.00710, 2500=0.00550 (EUR); Mount: Surface Mount; Case/Package: 0603; Weight: 7.1E-05oz; Contact Plating: Tin; Case Code (Metric): 1608; Case Code (Imperial): 0603; Min Operating Temperature: -55°C; Max Operating Temperature: 155°C; Composition: Thick Film; Resistance: 330R; Tolerance: 1%; Termination: SMD/SMT; Packaging: Tape and Reel; Package Quantity: 10; Number of Terminations: 2; Military Standard: Not; Max Power Dissipation: 100mW; Voltage Rating (DC): 75V; Features: Automotive AEC-Q200; Length: 1.55mm; Height: 0.45mm; Width: 0.033inch; Depth: 0.85mm; Radiation Hardening: No; Lead Free: Lead Free; REACH SVHC: Unknown; ComponentLink1URL: https://datasheet.ciiva.com/11809/0900766b80d98afc-11809055.pdf?src-supplier=RSComponents; ComponentLink1Description: https://datasheet.ciiva.com/11809/0900766b80d98afc-11809055.pdf?src-supplier=RSComponents; ComponentLink2URL: https://datasheet.ciiva.com/2465/dcrcwe3-2465777.pdf?src-supplier=Digi-Key; ComponentLink2Description: https://datasheet.ciiva.com/2465/dcrcwe3-2465777.pdf?src-supplier=Digi-Key; ComponentLink3URL: https://datasheet.ciiva.com/2465/dcrcwe3-2465778.pdf?src-supplier=Digi-Key; ComponentLink3Description: https://datasheet.ciiva.com/2465/dcrcwe3-2465778.pdf?src-supplier=Digi-Key; ComponentLink4URL: https://datasheet.ciiva.com/2465/dcrcwe3-2465779.pdf?src-supplier=Digi-Key; ComponentLink4Description: https://datasheet.ciiva.com/2465/dcrcwe3-2465779.pdf?src-supplier=Digi-Key; ComponentLink5URL: https://datasheet.ciiva.com/5543/dcrcwe3-109170-5543013.pdf?src-supplier=Mouser; ComponentLink5Description: https://datasheet.ciiva.com/5543/dcrcwe3-109170-5543013.pdf?src-supplier=Mouser; ComponentLink6URL: https://datasheet.ciiva.com/16772/70201119-16772038.pdf?src-supplier=Allied+Electronics; ComponentLink6Description: https://datasheet.ciiva.com/16772/70201119-16772038.pdf?src-supplier=Allied+Electronics; ComponentLink7URL: https://datasheet.ciiva.com/26316/fld-crcw-e3-data-en-26316538.pdf?src-supplier=Distrelec; ComponentLink7Description: https://datasheet.ciiva.com/26316/fld-crcw-e3-data-en-26316538.pdf?src-supplier=Distrelec; ComponentLink8URL: https://datasheet.ciiva.com/15225/getdatasheetpartid-32830-15225339.pdf?src-supplier=Verical; ComponentLink8Description: https://datasheet.ciiva.com/15225/getdatasheetpartid-32830-15225339.pdf?src-supplier=Verical; ComponentLink9URL: https://datasheet.ciiva.com/16372/dcrcwe3-16372971.pdf?src-supplier=Future+Electronics; ComponentLink9Description: https://datasheet.ciiva.com/16372/dcrcwe3-16372971.pdf?src-supplier=Future+Electronics; ComponentLink10URL: https://datasheet.ciiva.com/16893/dcrcwe3-16893227.pdf?src-supplier=Avnet+Europe; ComponentLink10Description: https://datasheet.ciiva.com/16893/dcrcwe3-16893227.pdf?src-supplier=Avnet+Europe; ComponentLink11URL: https://datasheet.ciiva.com/7777/1697337-7777311.pdf?src-supplier=Element14; ComponentLink11Description: https://datasheet.ciiva.com/7777/1697337-7777311.pdf?src-supplier=Element14; Price: 0.0165
U1 = ATMEGA328PB-AU: IC MCU 8BIT 32KB FLASH 32TQFP; Manufacturer: Microchip; Supplier 1: Farnell; Supplier Part Number 1: 2523203; Manufacturer Part Number: ATMEGA328PB-AU; RoHS: No; Category: Microcontrollers; Stock 1: 2845; Case/Package: TQFP; ComponentLink1URL: http://www.farnell.com/datasheets/2915218.pdf?src-supplier=Farnell; ComponentLink1Description: http://www.farnell.com/datasheets/2915218.pdf?src-supplier=Farnell; ComponentLink2URL: http://www.farnell.com/datasheets/2915218.pdf?src-supplier=Newark; ComponentLink2Description: http://www.farnell.com/datasheets/2915218.pdf?src-supplier=Newark; ComponentLink3URL: http://www.microchip.com/mymicrochip/filehandler.aspx?ddocname=en589666&src-supplier=Digi-Key; ComponentLink3Description: http://www.microchip.com/mymicrochip/filehandler.aspx?ddocname=en589666&src-supplier=Digi-Key; Price: 1.13
Y1 = ABM10-166-12.000MHZ-T3: CRYSTAL 12 MHz SMD 28 pF 10 ppm; Manufacturer: Abracon; Frequency Stability: 10ppm; Frequency: 12MHz; Load Capacitance: 8pF; ESR (Equivalent Series Resistance): 125R; Supplier 1: Farnell; Supplier Part Number 1: 2849406; Manufacturer Part Number: ABM10-166-12.000MHZ-T3; RoHS: Yes; Category: Crystals; Stock: 5674; Mount: Surface Mount; Case/Package: SMD/SMT; Min Operating Temperature: -20°C; Max Operating Temperature: 70°C; Frequency Tolerance: 10ppm; Packaging: Tape and Reel; Length: 0.098inch; Height: 0.02inch; Width: 0.079inch; ComponentLink1URL: http://www.farnell.com/datasheets/2581417.pdf?src-supplier=Farnell; ComponentLink1Description: http://www.farnell.com/datasheets/2581417.pdf?src-supplier=Farnell; ComponentLink2URL: https://abracon.com/Resonators/ABM10-XXX_packagedrawing.PDF?src-supplier=Digi-Key; ComponentLink2Description: https://abracon.com/Resonators/ABM10-XXX_packagedrawing.PDF?src-supplier=Digi-Key; Price: 0.41